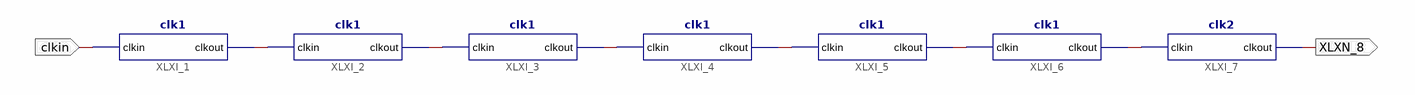
[diagram p0: schematic sheet 1]
// Xilinx ISE schematic clk5.sch (spartan3e) as structural Verilog: 7 symbols, 2 ports
module clk5 (
  input  clkin,
  output XLXN_8
);

  wire XLXN_1, XLXN_2, XLXN_3, XLXN_4, XLXN_5, XLXN_6;

  clk1 XLXI_1 (.clkin(clkin), .clkout(XLXN_1));
  clk1 XLXI_2 (.clkin(XLXN_1), .clkout(XLXN_2));
  clk1 XLXI_3 (.clkin(XLXN_2), .clkout(XLXN_3));
  clk1 XLXI_4 (.clkin(XLXN_3), .clkout(XLXN_4));
  clk1 XLXI_5 (.clkin(XLXN_4), .clkout(XLXN_5));
  clk1 XLXI_6 (.clkin(XLXN_5), .clkout(XLXN_6));
  clk2 XLXI_7 (.clkin(XLXN_6), .clkout(XLXN_8));
endmodule
